# EAGLE design RFID_Brd (EAGLE 7.2.0)
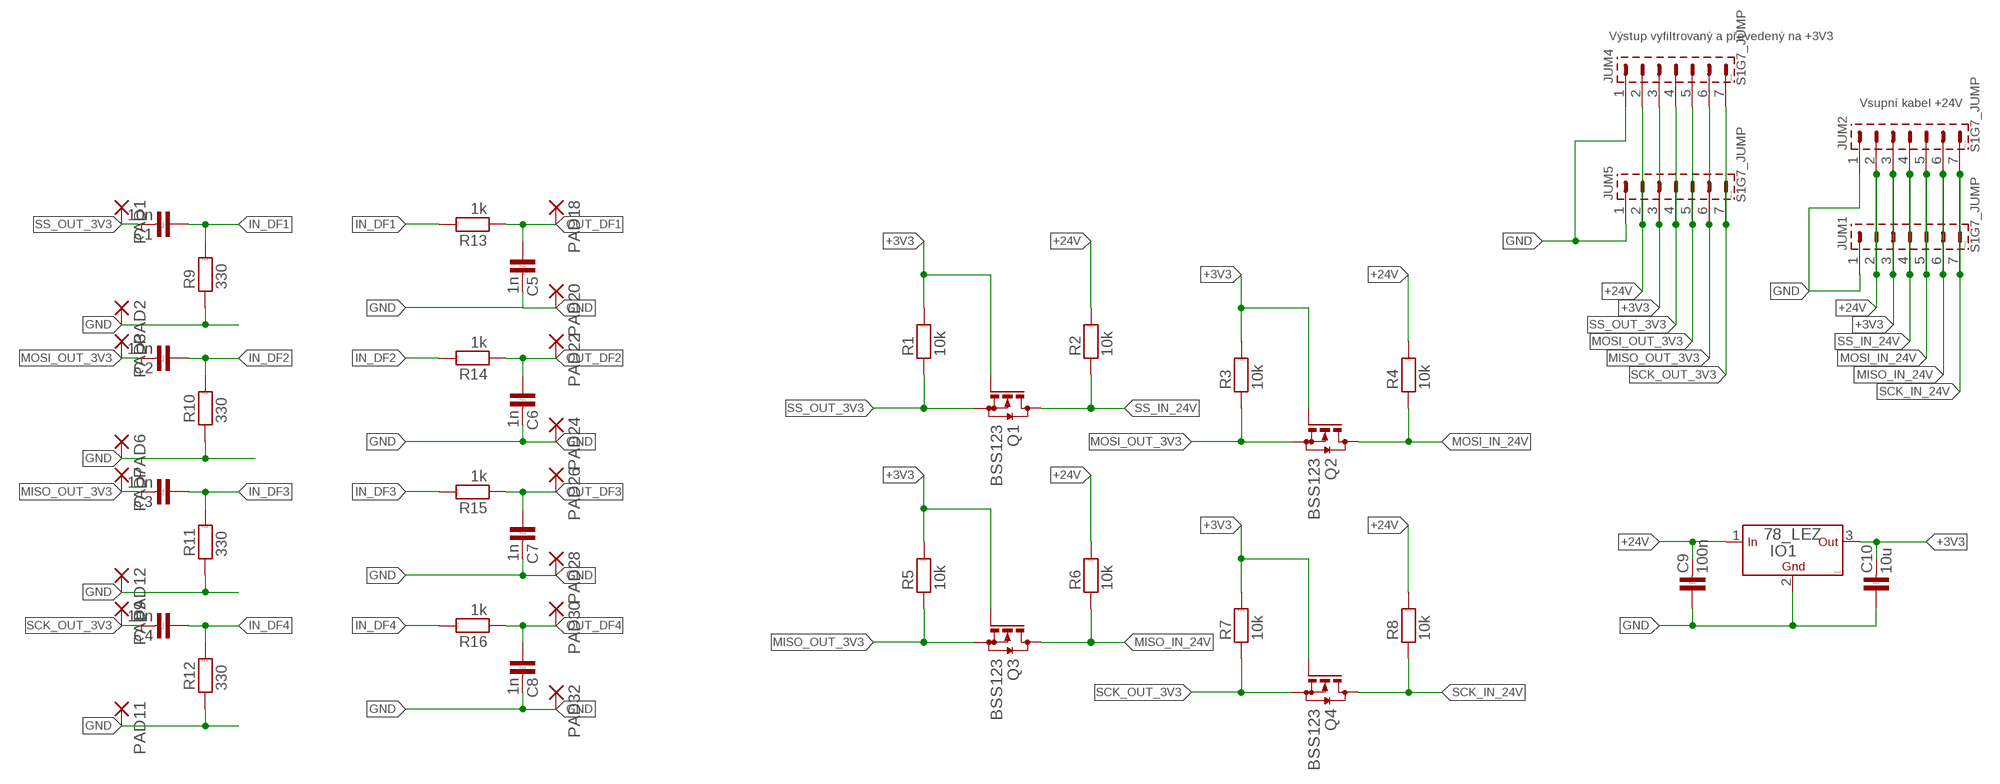
[diagram p0: schematic, sheet 1]

## Parts
C1  10n  C-KER_1206  [1206]
C2  10n  C-KER_1206  [1206]
C3  10n  C-KER_1206  [1206]
C4  10n  C-KER_1206  [1206]
C5  1n  C-KER_1206  [1206]
C6  1n  C-KER_1206  [1206]
C7  1n  C-KER_1206  [1206]
C8  1n  C-KER_1206  [1206]
C9  100n  C-KER_1206  [1206]
C10  10u  C-KER_1206  [1206]
IO1  78_LEZ  [TO-220]
JUM1  S1G7_JUMP  [S1G7_JUM]
JUM2  S1G7_JUMP  [S1G7_JUM]
JUM4  S1G7_JUMP  [S1G7_JUM]
JUM5  S1G7_JUMP  [S1G7_JUM]
PAD1  SMD2  [SMD1,27-2,54]
PAD2  SMD2  [SMD1,27-2,54]
PAD3  SMD2  [SMD1,27-2,54]
PAD6  SMD2  [SMD1,27-2,54]
PAD7  SMD2  [SMD1,27-2,54]
PAD9  SMD2  [SMD1,27-2,54]
PAD11  SMD2  [SMD1,27-2,54]
PAD12  SMD2  [SMD1,27-2,54]
PAD18  SMD2  [SMD1,27-2,54]
PAD20  SMD2  [SMD1,27-2,54]
PAD22  SMD2  [SMD1,27-2,54]
PAD24  SMD2  [SMD1,27-2,54]
PAD26  SMD2  [SMD1,27-2,54]
PAD28  SMD2  [SMD1,27-2,54]
PAD30  SMD2  [SMD1,27-2,54]
PAD32  SMD2  [SMD1,27-2,54]
Q1  BSS123  [SOT23]
Q2  BSS123  [SOT23]
Q3  BSS123  [SOT23]
Q4  BSS123  [SOT23]
R1  10k  R_1206  [1206]
R2  10k  R_1206  [1206]
R3  10k  R_1206  [1206]
R4  10k  R_1206  [1206]
R5  10k  R_1206  [1206]
R6  10k  R_1206  [1206]
R7  10k  R_1206  [1206]
R8  10k  R_1206  [1206]
R9  330  R_1206  [1206]
R10  330  R_1206  [1206]
R11  330  R_1206  [1206]
R12  330  R_1206  [1206]
R13  1k  R_1206  [1206]
R14  1k  R_1206  [1206]
R15  1k  R_1206  [1206]
R16  1k  R_1206  [1206]

## Nets
+3V3: C10.2 IO1.3(OUT) JUM1.3 JUM2.3 JUM4.3 JUM5.3 Q1.1(G) Q2.1(G) Q3.1(G) Q4.1(G) R1.2 R3.2 R5.2 R7.2
+24V: C9.2 IO1.1(IN) JUM1.2 JUM2.2 JUM4.2 JUM5.2 R2.2 R4.2 R6.2 R8.2
GND: C5.2 C6.2 C7.2 C8.2 C9.1 C10.1 IO1.2(GND) JUM1.1 JUM2.1 JUM4.1 JUM5.1 PAD2.1(P) PAD6.1(P) PAD11.1(P) PAD12.1(P) PAD20.1(P) PAD24.1(P) PAD28.1(P) PAD32.1(P) R9.1 R10.1 R11.1 R12.1
IN_DF1: C1.1 R9.2 R13.2
IN_DF2: C2.1 R10.2 R14.2
IN_DF3: C3.1 R11.2 R15.2
IN_DF4: C4.1 R12.2 R16.2
MISO_IN_24V: JUM1.6 JUM2.6 Q3.3(D) R6.1
MISO_OUT_3V3: C3.2 JUM4.6 JUM5.6 PAD7.1(P) Q3.2(S) R5.1
MOSI_IN_24V: JUM1.5 JUM2.5 Q2.3(D) R4.1
MOSI_OUT_3V3: C2.2 JUM4.5 JUM5.5 PAD3.1(P) Q2.2(S) R3.1
OUT_DF1: C5.1 PAD18.1(P) R13.1
OUT_DF2: C6.1 PAD22.1(P) R14.1
OUT_DF3: C7.1 PAD26.1(P) R15.1
OUT_DF4: C8.1 PAD30.1(P) R16.1
SCK_IN_24V: JUM1.7 JUM2.7 Q4.3(D) R8.1
SCK_OUT_3V3: C4.2 JUM4.7 JUM5.7 PAD9.1(P) Q4.2(S) R7.1
SS_IN_24V: JUM1.4 JUM2.4 Q1.3(D) R2.1
SS_OUT_3V3: C1.2 JUM4.4 JUM5.4 PAD1.1(P) Q1.2(S) R1.1

## Notes on the sheet
- Výstup vyfiltrovaný a převedený na +3V3
- Vsupní kabel +24V

## Library data of the parts
C1-C10 = #PaJa_31:C-KER: Kondenzator - keramicky
IO1 = #PaJa_31:78?: Stabilizator - 1A a 1,5A ? - napeti => 05, 06, 08, 09, 12, 15, 18, 20, 24 => 1,5A ? - napeti => 10, 12, 15, 18 => 1A S ? - napeti => 05, 09, 10, 12, 15, 18, 24 => 2A T ? - napeti => 05 => 3A ------------------------------------------------------- Stabilizator - 100mA (TO-92 , SOT-89) ? - napeti => 02, 05, 06, 08, 09, 12, 15, 18
JUM1 JUM2 JUM4 JUM5 = #PaJa_konektory:S1G7_JUMP: Radove konektory - koliky - 7x
PAD1-PAD3 PAD6 PAD7 PAD9 PAD11 PAD12 PAD18 PAD20 PAD22 PAD24 PAD26 PAD28 PAD30 PAD32 = wirepad:SMD2: SMD PAD
Q1-Q4 = transistor-small-signal:BSS123: N-CHANNEL MOS FET
R1-R16 = #PaJa_31:R: Rezistor

## Board
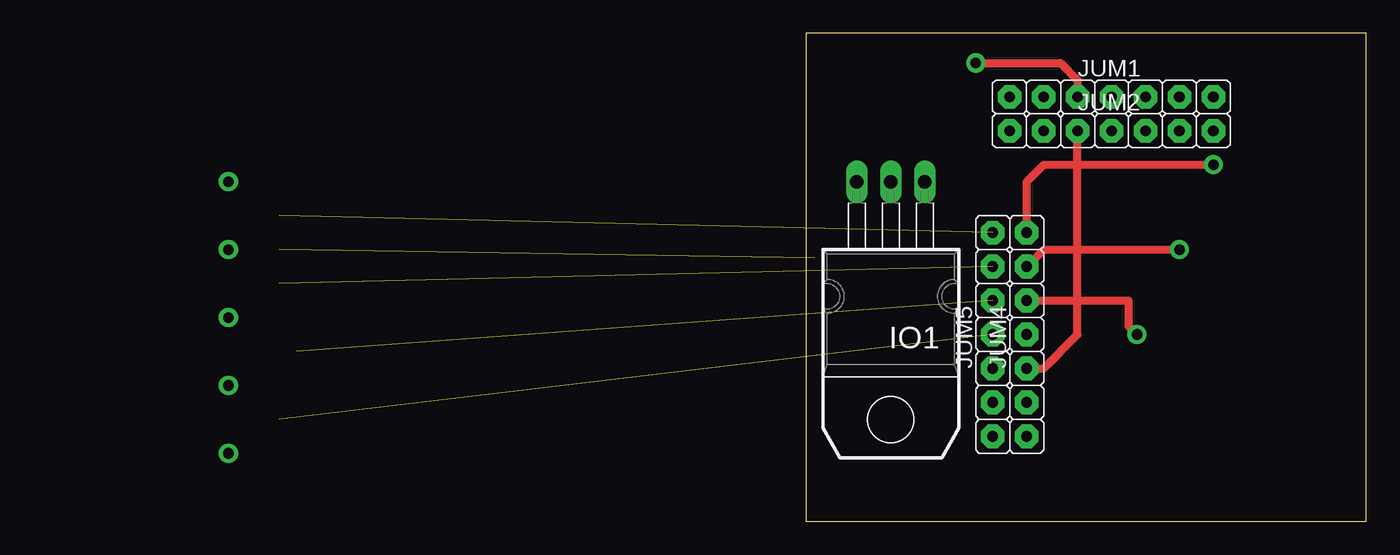
[diagram p1: board, top side]
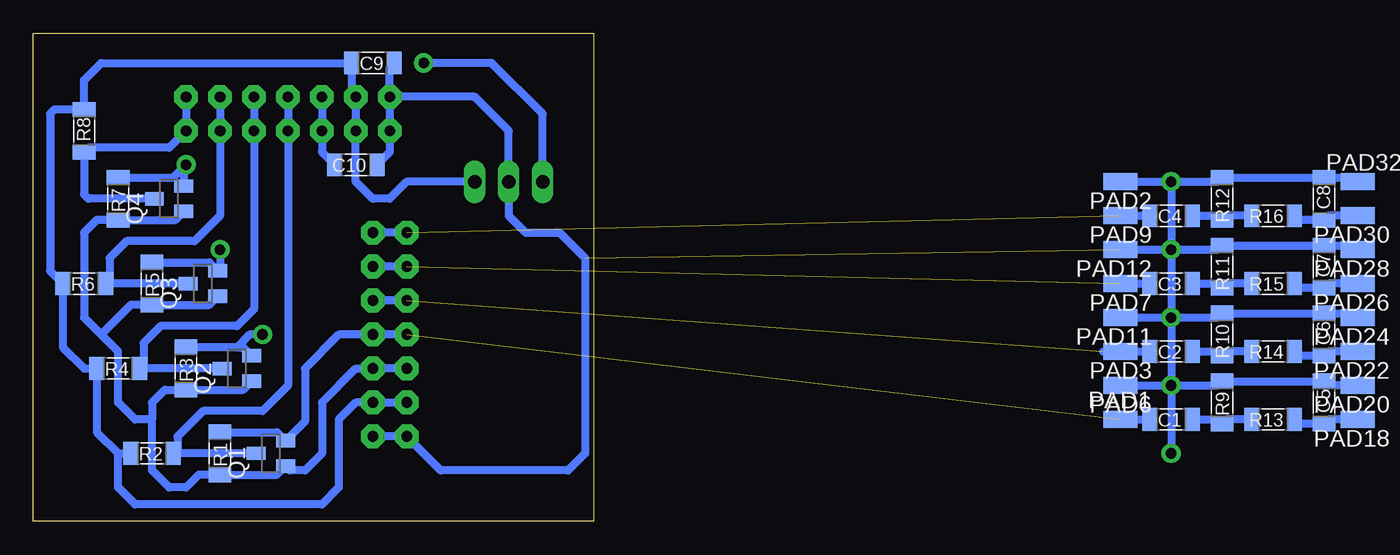
[diagram p2: board, bottom side, seen from below]

Size 41.89 x 36.5 mm. Coordinates in mm from the lower left corner, seen from the top.
Outline: 0,0 10.16,0 41.89,0 41.89,36.5 0,36.5 0,0
Copper layers (1*16): Top 0.035mm / dielectric 1.5mm / Bottom 0.035mm
Design rules "default": minimum track width 10mil, minimum drill 24mil, track to track 8mil, track to pad 8mil, pad to pad 8mil, via to via 8mil, smd to smd 8mil, copper to edge 40mil, drill to drill 8mil, minimum pad ring 10mil, minimum via ring 8mil, stop-mask expansion 4mil, vias tented up to drill 0mil, thermal gap 10mil

### Footprints (pad centres in the part's own frame; a part is rotated, then mirrored left to right if it is on the bottom)
1206 = smd 1.143 x 1.702: 1 -1.587,0; 2 1.587,0
TO-220 = drill 1.016 pad 1.6 long: 1 -2.54,0; 2 0,0; 3 2.54,0
S1G7_JUM = drill 0.813 pad 1.778 octagon: 1 -7.62,0; 2 -5.08,0; 3 -2.54,0; 4 0,0; 5 2.54,0; 6 5.08,0; 7 7.62,0
SMD1,27-2,54 = smd 1.27 x 2.54: 1 0,0
SOT23 = smd 1 x 1.4: 1 -0.95,-1.1; 2 0.95,-1.1; 3 0,1.1

### Placement (x,y rotation side)
C1  -43.18,7.62 180 bottom  (outside the outline)
C2  -43.18,12.7 180 bottom  (outside the outline)
C3  -43.18,17.78 180 bottom  (outside the outline)
C4  -43.18,22.86 180 bottom  (outside the outline)
C5  -54.61,8.89 90 bottom  (outside the outline)
C6  -54.61,13.97 90 bottom  (outside the outline)
C7  -54.61,19.05 90 bottom  (outside the outline)
C8  -54.61,24.13 90 bottom  (outside the outline)
C9  16.51,34.29 180 bottom
C10  17.78,26.67 180 bottom
IO1  6.35,25.4 180 top
JUM1  22.86,31.75 0 top
JUM2  22.86,29.21 0 top
JUM4  16.51,13.97 90 top
JUM5  13.97,13.97 90 top
PAD1  -39.37,7.62 270 bottom  (outside the outline)
PAD2  -39.37,25.4 90 bottom  (outside the outline)
PAD3  -39.37,12.7 90 bottom  (outside the outline)
PAD6  -39.37,10.16 90 bottom  (outside the outline)
PAD7  -39.37,17.78 90 bottom  (outside the outline)
PAD9  -39.37,22.86 90 bottom  (outside the outline)
PAD11  -39.37,15.24 90 bottom  (outside the outline)
PAD12  -39.37,20.32 90 bottom  (outside the outline)
PAD18  -57.15,7.62 90 bottom  (outside the outline)
PAD20  -57.15,10.16 90 bottom  (outside the outline)
PAD22  -57.15,12.7 90 bottom  (outside the outline)
PAD24  -57.15,15.24 90 bottom  (outside the outline)
PAD26  -57.15,17.78 90 bottom  (outside the outline)
PAD28  -57.15,20.32 90 bottom  (outside the outline)
PAD30  -57.15,22.86 90 bottom  (outside the outline)
PAD32  -57.15,25.4 270 bottom  (outside the outline)
Q1  24.13,5.08 90 bottom
Q2  26.67,11.43 90 bottom
Q3  29.21,17.78 90 bottom
Q4  31.75,24.13 90 bottom
R1  27.94,5.08 270 bottom
R2  33.02,5.08 180 bottom
R3  30.48,11.43 270 bottom
R4  35.56,11.43 180 bottom
R5  33.02,17.78 270 bottom
R6  38.1,17.78 180 bottom
R7  35.56,24.13 270 bottom
R8  38.1,29.21 90 bottom
R9  -46.99,8.89 270 bottom  (outside the outline)
R10  -46.99,13.97 270 bottom  (outside the outline)
R11  -46.99,19.05 270 bottom  (outside the outline)
R12  -46.99,24.13 270 bottom  (outside the outline)
R13  -50.8,7.62 180 bottom  (outside the outline)
R14  -50.8,12.7 180 bottom  (outside the outline)
R15  -50.8,17.78 180 bottom  (outside the outline)
R16  -50.8,22.86 180 bottom  (outside the outline)

### Tracks (layer width: path | path; a pad name or v marks a point on that pad's centre or on a via)
+3V3  (via drill 0.8 pad 1.42)
  Top 0.61: JUM4.3 17.78,11.43 20.32,13.97 JUM2.3 | v12.7,34.29 19.05,34.29 20.32,33.02 JUM1.3
  Bottom 0.61: Q4.1 31.29,22.54 R7.2 37.15,22.54 38.1,21.59 38.1,15.24 36.83,13.97 | Q3.1 28.75,16.19 R5.2 34.61,16.19 36.83,13.97 | 33.02,7.62 34.29,7.62 35.56,8.89 35.56,12.7 36.83,13.97 | 33.02,7.62 33.02,3.81 31.75,2.54 30.48,2.54 29.53,3.49 R1.2 23.67,3.49 Q1.1 22.71,3.81 21.59,3.81 20.32,5.08 20.32,8.89 17.78,11.43 JUM4.3 JUM5.3 | 33.02,7.62 33.02,8.89 32.07,9.84 R3.2 26.21,9.84 Q2.1 | JUM1.3 JUM2.3 20.32,27.62 C10.2 | IO1.3 3.81,30.48 7.62,34.29 v12.7,34.29
+24V
  Bottom 0.61: 35.56,5.08 37.15,6.67 R4.2 38.1,11.43 39.69,13.02 R6.2 40.64,18.73 40.64,30.48 40.32,30.8 R8.2 38.1,33.02 36.83,34.29 C9.2 18.1,32.07 JUM1.2 JUM2.2 17.78,25.4 16.51,24.13 15.24,24.13 13.97,25.4 IO1.1 | 35.56,5.08 R2.2 | 35.56,5.08 35.56,2.54 34.29,1.27 20.32,1.27 19.05,2.54 19.05,7.62 17.78,8.89 JUM4.2 JUM5.2
GND  (via drill 0.8 pad 1.42)  (1 unrouted)
  Bottom 0.61: PAD20.1 -54.93,10.16 C5.2 -54.61,10.16 -54.29,10.48 R9.1 -46.67,10.16 v-43.18,10.16 | PAD28.1 -56.83,20.64 C7.2 R11.1 -46.67,20.32 v-43.18,20.32 | PAD32.1 -56.83,25.72 C8.2 R12.1 -46.67,25.4 v-43.18,25.4 | PAD2.1 v-43.18,25.4 | PAD12.1 v-43.18,20.32 | PAD11.1 v-43.18,15.24 | v-43.18,15.24 -46.67,15.24 R10.1 C6.2 -56.83,15.56 PAD24.1 | PAD6.1 v-43.18,10.16 | JUM4.1 JUM5.1 11.43,3.81 1.9,3.81 0.63,5.08 0.63,19.68 2.54,21.59 5.08,21.59 6.35,22.86 IO1.2 6.35,29.21 8.89,31.75 JUM1.1 | JUM1.1 JUM2.1 15.24,27.62 C10.1 | v-43.18,25.4 v-43.18,20.32 | v-43.18,20.32 v-43.18,15.24 | v-43.18,15.24 v-43.18,10.16 | v-43.18,10.16 v-43.18,5.08 | JUM1.1 15.24,33.97 C9.1
IN_DF1
  Bottom 0.61: C1.1 -46.67,7.62 R9.2 -47.31,7.62 R13.2
IN_DF2
  Bottom 0.61: R14.2 -47.31,12.7 R10.2 -46.67,12.7 C2.1
IN_DF3
  Bottom 0.61: C3.1 -46.67,17.78 R11.2 -46.99,17.78 R15.2
IN_DF4
  Bottom 0.61: C4.1 -46.67,22.86 R12.2 -47.31,22.86 R16.2
MISO_IN_24V
  Bottom 0.61: Q3.3 R6.1 36.2,18.1 36.2,19.68 34.92,20.95 29.84,20.95 27.94,22.86 JUM2.6 JUM1.6
MISO_OUT_3V3  (via drill 0.8 pad 1.42)  (1 unrouted)
  Top 0.61: JUM4.6 17.78,20.32 v27.94,20.32
  Bottom 0.61: R5.1 28.75,19.37 Q3.2 27.94,18.9 v27.94,20.32 | JUM5.6 JUM4.6 | PAD7.1 C3.2
MOSI_IN_24V
  Bottom 0.61: Q2.3 R4.1 33.66,11.75 33.66,13.34 32.39,14.61 26.67,14.61 25.4,15.88 JUM2.5 JUM1.5
MOSI_OUT_3V3  (via drill 0.8 pad 1.42)  (1 unrouted)
  Top 0.61: v24.77,13.97 24.13,14.61 24.13,16.51 JUM4.5
  Bottom 0.61: v24.77,13.97 25.72,13.97 26.67,13.02 | JUM5.5 JUM4.5 | -38.1,12.7 PAD3.1 C2.2 | 26.67,13.02 26.21,13.02 Q2.2 | 26.67,13.02 R3.1
OUT_DF1
  Bottom 0.61: PAD18.1 -54.93,7.62 C5.1 -52.7,7.3 R13.1
OUT_DF2
  Bottom 0.61: PAD22.1 -54.93,12.7 C6.1 -52.7,12.38 R14.1
OUT_DF3
  Bottom 0.61: PAD26.1 -54.93,17.78 C7.1 -52.7,17.46 R15.1
OUT_DF4
  Bottom 0.61: PAD30.1 -54.93,22.86 C8.1 -52.7,22.54 R16.1
SCK_IN_24V
  Bottom 0.61: Q4.3 37.78,24.13 38.1,24.45 R8.1 37.78,27.94 31.75,27.94 JUM2.7 JUM1.7
SCK_OUT_3V3  (via drill 0.8 pad 1.42)  (1 unrouted)
  Top 0.61: JUM4.7 16.51,25.4 17.78,26.67 v30.48,26.67
  Bottom 0.61: JUM5.7 JUM4.7 | PAD9.1 C4.2 | Q4.2 30.65,26.5 v30.48,26.67 31.43,25.72 R7.1
SS_IN_24V
  Bottom 0.61: Q1.3 R2.1 | JUM1.4 JUM2.4 22.86,10.16 24.77,8.26 29.21,8.26 31.11,6.35 31.11,5.4 R2.1 | 31.75,5.08 R2.1
SS_OUT_3V3  (1 unrouted)
  Bottom 0.61: JUM5.4 JUM4.4 19.05,13.97 21.59,11.43 21.59,7.47 Q1.2 23.67,6.67 R1.1 | PAD1.1 C1.2